# EAGLE design Geiger (EAGLE 7.6.0)
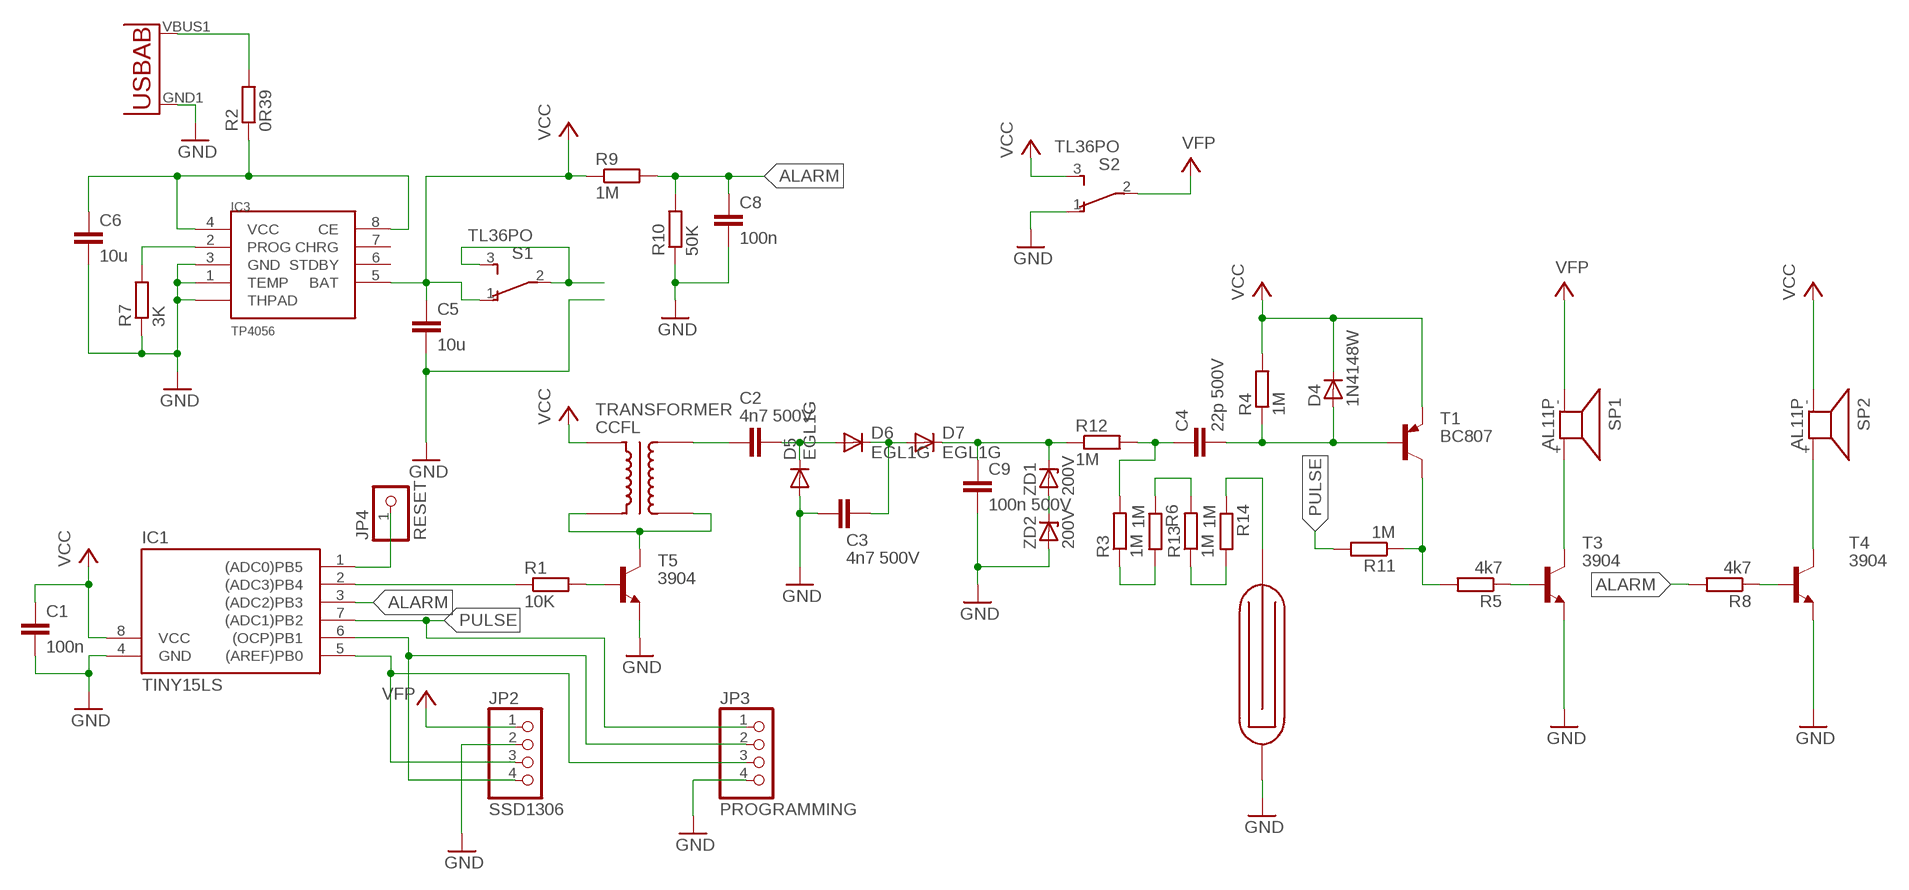
[diagram p0: schematic, sheet 1]

## Parts
C1  100n  C-EUC0805  [C0805]
C2  4n7 500V  C-EUC1206  [C1206]
C3  4n7 500V  C-EUC1206  [C1206]
C4  22p 500V  C-EU050-024X044  [C050-024X044]
C5  10u  C-EUC0805  [C0805]
C6  10u  C-EUC0805  [C0805]
C8  100n  C-EUC0805  [C0805]
C9  100n 500V  C-EU150-054X183  [C150-054X183]
D4  1N4148W  D-SOD123  [SOD123]
D5  EGL1G  PMLL4150  [SOD80C]
D6  EGL1G  PMLL4150  [SOD80C]
D7  EGL1G  PMLL4150  [SOD80C]
IC1  TINY15LS  [SOIC8]
IC3  TP4056  [SOP-8]
JP2  SSD1306  PINHD-1X4  [1X04]
JP3  PROGRAMMING  PINHD-1X4  [1X04]
JP4  RESET  PINHD-1X1  [1X01]
R1  10K  R-EU_R0805  [R0805]
R2  0R39  R-EU_R1206  [R1206]
R3  1M  R-EU_R0805  [R0805]
R4  1M  R-EU_R0805  [R0805]
R5  4k7  R-EU_R0805  [R0805]
R6  1M  R-EU_R0805  [R0805]
R7  3K  R-EU_R0805  [R0805]
R8  4k7  R-EU_R0805  [R0805]
R9  1M  R-EU_R0805  [R0805]
R10  50K  R-EU_R0805  [R0805]
R11  1M  R-EU_R0805  [R0805]
R12  1M  R-EU_R0805  [R0805]
R13  1M  R-EU_R0805  [R0805]
R14  1M  R-EU_R0805  [R0805]
S1  TL36PO  [TL3XPO]
S2  TL36PO  [TL3XPO]
SP1  AL11P  [AL11P]
SP2  AL11P  [AL11P]
T1  BC807  BC807-16-PNP-SOT23-BEC  [SOT23-BEC]
T3  3904  MMBT3904LT1-NPN-SOT23-BEC  [SOT23-BEC]
T4  3904  MMBT3904LT1-NPN-SOT23-BEC  [SOT23-BEC]
T5  3904  MMBT3904LT1-NPN-SOT23-BEC  [SOT23-BEC]
TRANSFORMER  CCFL  [CCFL]
U2  USB  USB""  [USB-MICRO-SMD]
U$1  SBM-20  [SBM-20]
ZD1  200V  ZD-MLL-41  [MELF-MLL41]
ZD2  200V  ZD-MLL-41  [MELF-MLL41]

## Nets
200V: ZD1.A ZD2.C
200V2: C2.2 D5.C D6.A
400V: C9.1 D7.C R12.1 ZD1.C
400V2: C4.1 R3.2 R12.2
400V3: C3.2 D6.C D7.A
ALARM: C8.1 IC1.3((ADC2)PB3) R8.2 R9.2 R10.2
GND: C1.2 C3.1 C5.2 C6.2 C8.2 C9.2 D5.A IC1.4(GND) IC3.1(TEMP) IC3.3(GND) IC3.P$1(THPAD) JP2.2 JP3.4 R7.1 R10.1 S2.1(O) T3.E T4.E T5.E U2.GND1(GND) U$1.P$2 ZD2.A
N$1: SP2.+ T4.C
N$2: C2.1 TRANSFORMER.HV
N$3: R8.1 T4.B
N$4: R1.2 T5.B
N$6: R3.1 R6.2
N$7: R6.1 R13.2
N$8: R14.1 U$1.P$1
N$9: R13.1 R14.2
N$10: R5.2 R11.1 T1.C
N$12: C4.2 D4.A R4.1 T1.B
N$13: IC1.1((ADC0)PB5) JP4.1
N$14: R5.1 T3.B
N$15: S1.2(P) S1.3(S)
N$16: C6.1 IC3.4(VCC) IC3.8(CE) R2.1
N$18: T5.C TRANSFORMER.TR1 TRANSFORMER.TR2
N$19: IC3.2(PROG) R7.2
N$22: IC1.5((AREF)PB0) JP2.3 JP3.3
N$23: IC1.6((OCP)PB1) JP2.4 JP3.2
OSC: IC1.2((ADC3)PB4) R1.1
PULSE: IC1.7((ADC1)PB2) JP3.1 R11.2
SPKR: SP1.+ T3.C
V+: JP2.1 S2.2(P) SP1.- ; supply symbol labelled VFP
VCC: C1.1 C5.1 D4.C IC1.8(VCC) IC3.5(BAT) R4.2 R9.1 S1.1(O) S2.3(S) SP2.- T1.E TRANSFORMER.V+
VCCUSB: R2.2 U2.VBUS1(VBUS)
Unconnected: IC3.6(STDBY) IC3.7(CHRG)

## Library data of the parts
C1-C6 C8 C9 = resistor:C-EU: CAPACITOR, European symbol
D4 = diodes2:D-: DIODE
D5-D7 = diode:PMLL4150: DIODE high speed
IC1 = atmel:TINY15L: MICROCONTROLLER 2.7 V 1 Kbytes FLASH 64 bytes EEPROM 4-channel 10 bit ADC; OC_FARNELL: unknown; OC_NEWARK: unknown
IC3 = Geiger:TP4056
JP2 JP3 = pinhead:PINHD-1X4: PIN HEADER
JP4 = pinhead:PINHD-1X1: PIN HEADER
R1-R14 = resistor:R-EU_: RESISTOR, European symbol
S1 S2 = switch:TL36PO: TINY SWITCH ON - ON Source: http://www2.produktinfo.conrad.com/datenblaetter/700000-724999/705152-da-01-de-Subminiaturschalter_TL_36YO.pdf
SP1 SP2 = buzzer:AL11P: SPEAKER Source: Buerklin; OC_FARNELL: unknown; OC_NEWARK: unknown
T1 = transistor:*-PNP-: PNP Transistror
T3-T5 = transistor:*-NPN-: NPN Transistror BF959 corrected 2008.03.06
TRANSFORMER = Geiger:CCFL
U2 = Geiger:USB: This is a USB AB connector that is compatible with USB OTG. i.e. this connector can serve as a host or device
U$1 = Geiger:SBM-20
ZD1 ZD2 = diodes2:ZD-: Zener diode

## Board
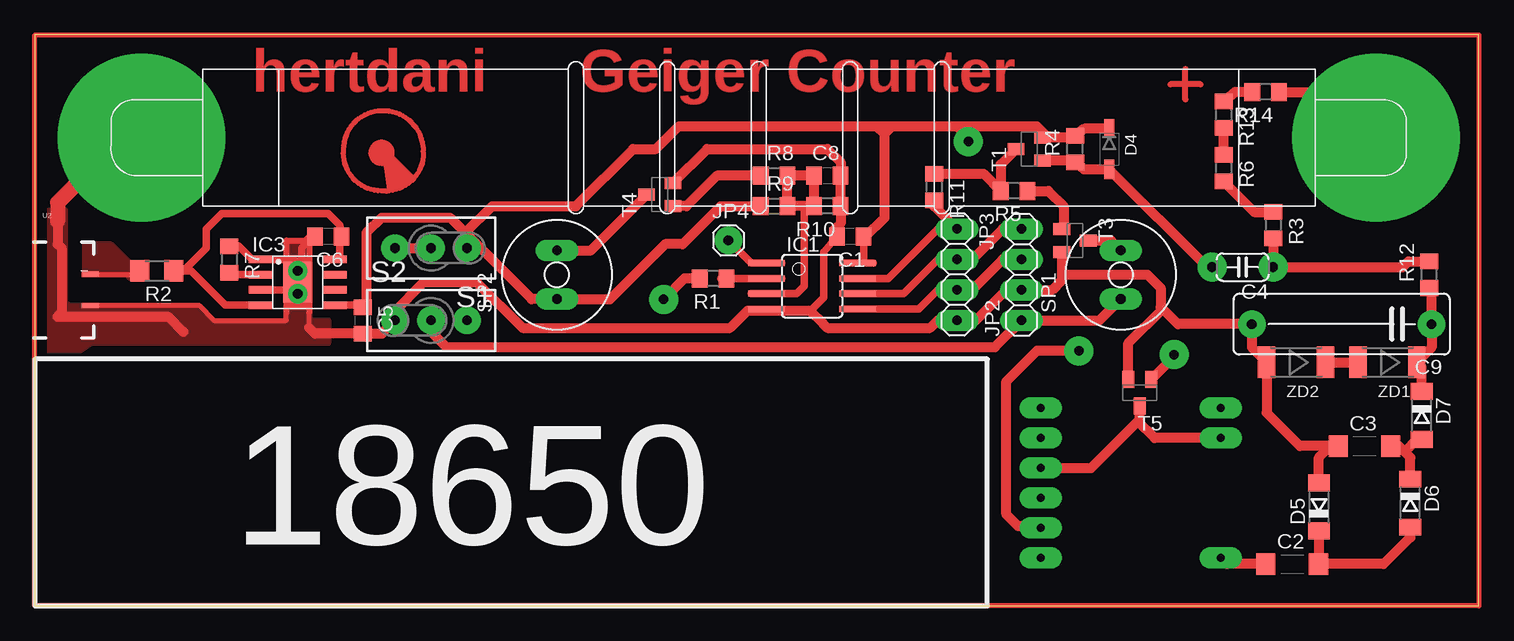
[diagram p1: board, top side]
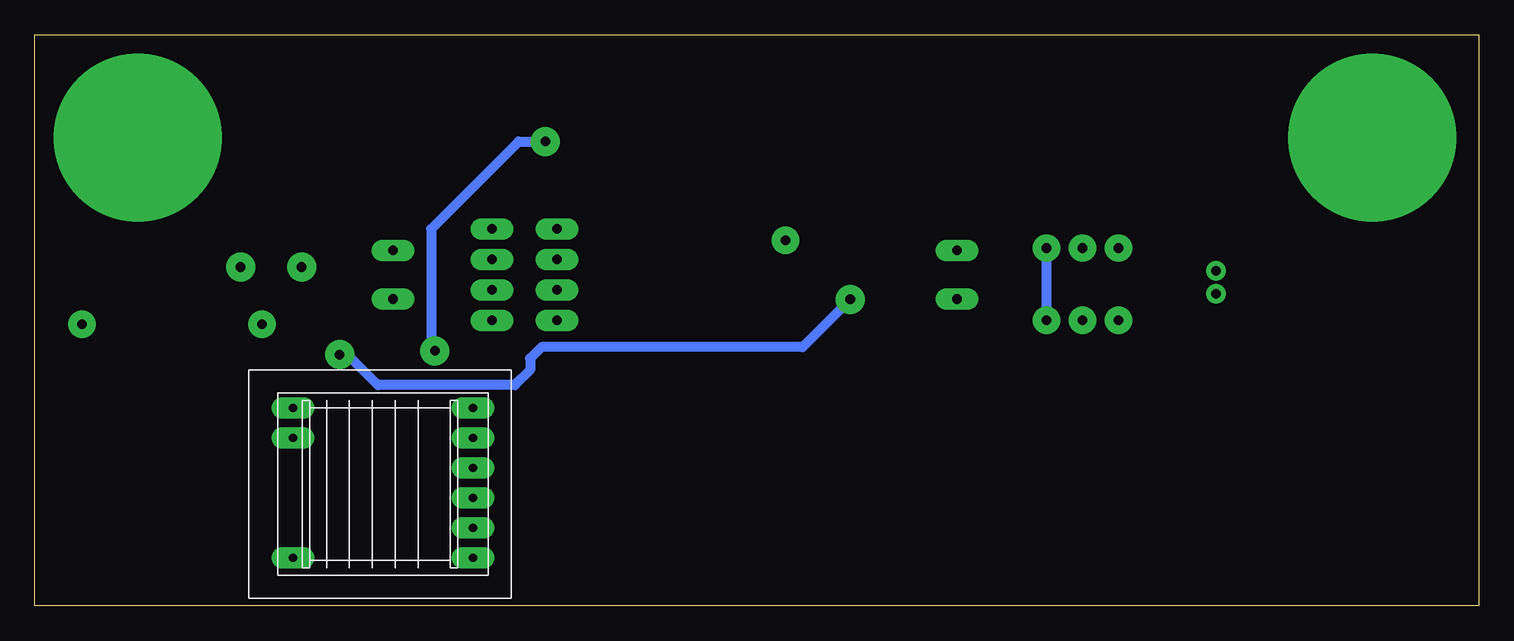
[diagram p2: board, bottom side, seen from below]

Size 120.33 x 47.62 mm. Coordinates in mm from the lower left corner, seen from the top.
Outline: 0,0 120.33,0 120.33,47.62 0,47.62 0,0
Copper layers (1*16): Top 0.035mm / dielectric 1.5mm / Bottom 0.035mm
Design rules "default *": minimum track width 16mil, minimum drill 24mil, track to track 25mil, track to pad 25mil, pad to pad 25mil, via to via 25mil, smd to smd 25mil, copper to edge 40mil, drill to drill 16mil, minimum pad ring 16mil, minimum via ring 16mil, stop-mask expansion 4mil, vias tented up to drill 0mil, thermal gap 10mil

### Footprints (pad centres in the part's own frame; a part is rotated, then mirrored left to right if it is on the bottom)
C0805 = smd 1.3 x 1.5: 1 -1.109,0; 2 1.109,0
C1206 = smd 1.6 x 1.8: 1 -2.194,0; 2 2.194,0
C050-024X044 = drill 0.8 pad 2.413: 1 -2.54,0; 2 2.54,0
C150-054X183 = drill 0.8 pad 2.286: 1 -7.493,0; 2 7.493,0
SOD123 = smd 1.6 x 0.8: A 1.7,0; C -1.7,0
SOD80C = smd 1.4 x 1.8: A 2,0; C -2,0
SOIC8 = smd 0.5 x 3.048: 1 -1.905,-3.789; 2 -0.645,-3.789; 3 0.625,-3.789; 4 1.895,-3.789; 5 1.905,3.789; 6 0.635,3.789; 7 -0.635,3.789; 8 -1.905,3.789
SOP-8 = smd 2.062 x 0.624: 1 -3.067,1.905; 2 -3.067,0.635; 3 -3.067,-0.635; 4 -3.067,-1.905; 5 3.067,-1.905; 6 3.067,-0.635; 7 3.067,0.635; 8 3.067,1.905 | smd 2.4 x 3.4: P$1 0,0
1X04 = drill 0.8 pad 1.778 long: 1 -3.81,0; 2 -1.27,0; 3 1.27,0; 4 3.81,0
1X01 = drill 0.8 pad 2.286: 1 0,0
R0805 = smd 1.3 x 1.5: 1 -1.109,0; 2 1.109,0
R1206 = smd 1.6 x 1.803: 1 -1.422,0; 2 1.422,0
TL3XPO = drill 0.8 pad 2.286: 1 -3,0; 2 0,0; 3 3,0
AL11P = drill 0.8 pad 1.778 long: + 2.032,0; - -2.032,0
SOT23-BEC = smd 1 x 1.4: B -0.95,-1.1; C 0,1.1; E 0.95,-1.1
CCFL = drill 0.7 pad 1.778 long: HV 12.5,15; P$1 12.5,0; P$3 7.5,0; P$5 2.5,0; P$6 0,0; P$7 0,15; TR1 5,0; TR2 2.5,15; V+ 10,0
USB-MICRO-SMD = smd 1.4 x 0.432: GND1 2.7,-1.3; VBUS1 2.7,1.3
SBM-20 = drill 0 pad 13.97: P$1 0,0; P$2 102.87,0
MELF-MLL41 = smd 1.45 x 2.6: A 2.445,0; C -2.445,0

### Placement (x,y rotation side)
C1  67.94,30.8 180 top
C2  104.78,3.49 0 top
C3  110.81,13.34 0 top
C4  100.65,28.26 180 top
C5  27.3,23.81 270 top
C6  24.45,30.8 180 top
C8  66.04,35.88 0 top
C9  108.9,23.5 180 top
D4  89.53,38.1 270 top
D5  107,8.26 90 top
D6  114.62,8.57 270 top
D7  115.57,15.88 270 top
IC1  64.77,26.67 270 top
IC3  21.91,26.99 0 top
JP2  82.23,27.62 90 top
JP3  76.83,27.62 270 top
JP4  57.78,30.48 0 top
R1  56.52,27.3 180 top
R2  10.16,27.94 180 top
R3  103.19,31.75 270 top
R4  86.68,38.1 90 top
R5  81.6,34.61 180 top
R6  99.06,36.51 270 top
R7  16.19,28.89 270 top
R8  61.59,35.88 0 top
R9  61.59,33.34 0 top
R10  66.04,33.34 180 top
R11  74.93,34.92 270 top
R12  116.2,27.62 90 top
R13  99.06,40.96 270 top
R14  102.55,42.86 180 top
S1  33.02,29.84 180 top
S2  33.02,23.81 0 top
SP1  90.49,27.62 90 top
SP2  43.5,27.62 90 top
T1  82.87,38.1 90 top
T3  86.68,30.48 270 top
T4  52.07,34.29 90 top
T5  92.08,17.78 180 top
TRANSFORMER  83.82,16.51 270 top
U2  1.91,26.35 0 top
U$1  111.76,39.05 180 top
ZD1  112.71,20.32 180 top
ZD2  105.09,20.32 180 top

### Tracks (layer width: path | path; a pad name or v marks a point on that pad's centre or on a via)
200V
  Top 0.813: ZD2.C ZD1.A
200V2
  Top 0.813: D5.C 107,3.52 C2.2 112.39,3.49 114.62,5.71 D6.A 114.62,6.35
400V
  Top 0.813: R12.1 116.39,26.48 C9.1 116.39,21.56 ZD1.C 115.57,19.91 D7.C
400V2
  Top 0.813: R3.2 C4.1 113.98,28.26 114.46,28.73 R12.2 116.05,28.57
400V3
  Top 0.813: C3.2 113.67,13.34 114.14,12.86 | D6.C 114.62,12.38 114.14,12.86 | D7.A 115.16,13.88 114.14,12.86
A
  Top 0.406: 29.53,37.47 31.11,35.56 31.11,35.58 arc90 31.1,35.59 | 29.21,34.61 arc90 32.38,37.78 arc90 29.21,41.27 28.89,41.27 arc90 25.72,38.1 25.72,37.78 arc90 28.89,34.61 29.21,34.61 | 29.53,34.77 29.21,37.15 28.89,37.15 | 29.53,34.77 29.84,34.77 29.21,36.99 29.69,37.47 31.43,35.72 31.1,35.59 | 31.1,35.59 30.83,35.48 | 30.83,35.48 29.84,35.08 | 29.21,34.61 29.37,34.61 arc90 29.53,34.77 | 30.8,35.56 30.8,35.51 arc90 30.83,35.48 | 28.89,38.42 28.89,38.1
  Top 0.61: 30.8,35.56 30.16,34.92 29.53,37.15 30.48,35.56 | 29.21,38.1 29.21,37.47 28.57,37.47 28.57,38.1 | 28.57,38.1 28.89,38.1 | 28.57,38.1 28.26,38.1 | 29.53,37.47 31.11,35.88
  Top 0.914: 29.53,37.78 arc90 28.89,38.42 arc90 28.26,37.78 arc90 28.89,37.15 arc90 29.53,37.78
ALARM
  Top 0.406: 62.55,33.34 R9.2
  Top 0.61: IC1.3 61.61,26.04 | 61.61,26.04 59.69,26.04 | 61.61,26.04 63.5,26.04 64.14,26.67 64.14,33.34 64.45,33.34
  Top 0.813: R8.2 R9.2 64.45,33.34 R10.2 C8.1 62.87,35.88
GND  (via drill 0.8)
  Top 0.406: 20.95,25.4 20.95,26.35 20.95,28.57 | 20.95,28.57 21.27,28.89 21.59,28.89 22.23,28.89 22.86,28.89 22.86,29.21 | 20.95,25.08 20.95,24.77 20.95,23.81 14.92,23.81 13.68,25.05 U2.GND1 | 20.95,25.08 20.95,25.4 | 20.95,25.4 22.86,25.4 22.86,24.77 22.86,23.18 | 20.95,25.08 22.54,25.08 | 66.99,35.88 C8.2 | 20.95,28.57 22.86,28.57 | 59.37,24.61 59.54,24.77 IC1.4
  Top 0.508: 22.86,30.48 22.86,24.77 22.86,24.45 | 20.95,24.45 20.95,24.77 20.95,26.35 20.95,30.48 22.54,30.48 | 23.18,30.48 22.54,30.48 | 22.54,30.48 23.18,31.11
  Top 0.61: C1.2 65.72,29.52 65.72,25.72 64.61,24.61 64.45,24.61 | 21.59,28.89 IC3.1 18.1,28.89 16.99,30 R7.1 | IC3.3 20.95,26.35 | C6.2 22.54,30.16 22.23,29.84 22.23,28.89
  Top 0.813: 66.99,30.8 C1.2 66.67,30.96 66.67,31.43 67.15,31.91 R10.1 | R10.1 C8.2 67.15,36.99 66.04,38.1 56.03,38.1 T4.E | 67,33.33 R10.1 | C3.1 107.95,13.34 | 107.95,13.34 105.41,13.34 102.65,16.1 ZD2.A 101.41,21.56 C9.2 95.25,23.5 93.98,24.77 | 85.58,27.16 84.77,26.35 JP2.2 80.96,26.35 78.42,23.81 JP3.4 75.25,23.81 74.61,23.18 66.04,23.18 65.73,23.48 65.73,23.5 64.62,24.61 64.45,24.61 59.37,24.61 57.94,23.18 40.64,23.18 36.83,26.99 32.38,26.99 29.84,24.45 29.84,23.99 S2.1 28.91,22.7 C5.2 23.33,22.7 22.86,23.18 | 85.58,27.16 85.72,27.62 92.71,27.62 93.82,26.51 93.82,24.92 93.98,24.77 | T3.E 85.58,27.16 | U$1.P$2 7.94,39.05 | 1.91,33.02 1.91,32.38 | 1.91,32.07 1.91,30.16 2.22,29.84 2.22,24.45 1.91,24.13 11.11,24.13 12.38,22.86 | T5.E 91.12,21.91 93.98,24.77 | D5.A 107,12.38 107.95,13.34
  Top 1.27: 7.94,39.05 6.99,39.05 | 1.91,32.07 1.91,32.38 1.91,33.66 8.26,40.01 8.26,39.69 U$1.P$2
  other vias: 21.91,27.94 21.91,26.04
  pour Top: 20.95,23.5 20.95,30.48 22.86,30.48 22.86,23.81 24.45,23.81 24.45,21.91 4.13,21.91 4.13,24.77 13.65,24.77 14.92,23.5
  pour Top: 0.32,33.02 2.54,33.02 2.54,25.4 2.86,25.08 4.76,25.08 4.76,21.91 3.81,21.27 0.64,21.27
N$1
  Top 0.813: SP2.+ 46.33,29.65 T4.C
N$2
  Top 0.813: 98.94,4.45 TRANSFORMER.HV 99.34,3.49 C2.1
N$3
  Top 0.406: R8.1 60.64,35.88
  Top 0.813: R8.1 56.83,35.88 54.29,33.34 T4.B
N$4  (via drill 0.8 pad 2.41)
  Top 0.813: R1.2 54.13,27.3 v52.39,25.56 | v94.93,20.95 94.93,20.79 T5.B
  Bottom 0.813: v52.39,25.56 56.36,21.59 78.11,21.59 79.06,20.64 79.06,19.68 80.33,18.41 91.76,18.41 94.3,20.95 v94.93,20.95
N$5
  Top 0.406: 0,0 0,47.62 120.33,47.62 120.33,0 0,0
N$6
  Top 0.813: R6.2 101.61,32.86 R3.1
N$7
  Top 0.813: R6.1 R13.2
N$8
  Top 0.813: R14.1 107.95,42.86 U$1.P$1
N$9
  Top 0.813: R14.2 100.02,42.86 R13.1
N$10
  Top 0.813: T1.C 80.49,36.82 R5.2 79.06,36.03 R11.1
N$12
  Top 0.813: T1.B 86.52,37.15 R4.1 87.43,36.4 D4.A 97.68,28.26 C4.2
N$13
  Top 0.61: 58.42,30.16 58.1,30.16 JP4.1 59.69,28.57 60.96,28.57 IC1.1 62.23,28.57
N$14
  Top 0.813: R5.1 84.45,34.61 85.72,33.34 85.72,31.58 T3.B
N$15
  Top 0.813: S1.3 S1.2
N$16
  Top 0.61: IC3.4 15.88,25.08 13.02,27.94 12.38,27.94 | 12.38,27.94 R2.1 | 12.38,27.94 14.29,29.84 14.29,31.43 15.56,32.7 24.45,32.7 25.4,31.75 C6.1 25.4,30.8 25.4,28.89 IC3.8
  Top 0.813: 11.84,27.68 R2.1
N$18
  Top 0.813: TRANSFORMER.TR1 88.03,11.51 91.92,15.4 | 91.92,15.4 92.08,15.56 T5.C | TRANSFORMER.TR2 93.31,14.01 91.92,15.4
N$19
  Top 0.61: IC3.2 16.51,27.62 R7.2
N$22
  Top 0.61: 76.52,26.35 JP3.3 75.25,26.35 73.66,24.77 IC1.5 67.31,24.77
  Top 0.813: JP3.3 78.11,26.35 80.64,28.89 JP2.3
N$23
  Top 0.61: 76.52,28.89 JP3.2 75.25,28.89 72.39,26.04 IC1.6 67.31,26.04
  Top 0.813: JP3.2 78.11,28.89 80.64,31.43 JP2.4
OSC
  Top 0.406: 61.59,27.3 61.6,27.32 IC1.2 61.61,27.3
  Top 0.61: 57.15,27.3 R1.1 61.59,27.3 61.61,27.3 62.23,27.3
PULSE
  Top 0.61: 76.52,31.43 JP3.1 75.25,31.43 71.12,27.3 IC1.7 67.31,27.3
  Top 0.813: JP3.1 74.93,33.34 R11.2
SPKR
  Top 0.813: T3.C 89.66,30.48 SP1.+
V+
  Top 0.813: SP1.- 88.71,23.81 JP2.1 80.01,21.59 34.29,21.59 33.02,22.86 S2.2
VCC  (via drill 0.8 pad 2.41)
  Top 0.61: IC3.5 27.62,25.08 C5.1 | 68.9,30.8 C1.1 69.05,28.57 | 69.05,28.57 69.85,28.57 | 67.31,28.57 IC1.8 69.05,28.57
  Top 0.813: 86.79,39.16 R4.2 | 84.45,39.05 T1.E | C1.1 69.22,30.8 70.8,32.38 70.8,39.37 | 70.17,40.01 53.66,40.01 51.75,38.1 49.85,38.1 45.09,33.34 38.1,33.34 35.88,31.11 | 70.17,40.01 71.44,40.01 | 78.42,40.01 83.5,40.01 84.45,39.05 | R9.1 57.15,33.34 53.98,30.16 52.51,30.16 47.94,25.59 SP2.- 41.4,25.59 36.51,30.48 | 70.8,39.37 70.17,40.01 | 70.8,39.37 71.44,40.01 | 77.79,39.37 78.42,40.01 | 71.44,40.01 76.83,40.01 | 76.83,40.01 78.42,40.01 | v77.79,38.73 77.79,39.05 76.83,40.01 | D4.C 87.43,39.8 R4.2 | C5.1 27.62,25.4 27.62,31.11 28.89,32.38 34.61,32.38 35.88,31.11 | S1.1 36.02,29.99 36.51,30.48 | 35.88,31.11 36.51,30.48 | TRANSFORMER.V+ 83.66,6.67 81.92,6.67 80.96,7.62 80.96,18.73 83.5,21.27 v87,21.27 | 84.45,39.05 84.46,39.05 86.52,39.05 R4.2
  Bottom 0.813: S2.3 S1.1 | 77.79,38.42 v77.79,38.73 80.01,38.73 87.31,31.43 87.31,21.59 v87,21.27 86.36,21.27
VCCUSB
  Top 0.406: U2.VBUS1 8.45,27.65 R2.2
  pour Top: 4.13,27.62 7.62,27.62 7.94,27.3 9.21,27.3 9.21,28.57 8.26,28.57 7.94,28.57 6.35,30.16 4.13,30.16

### Text on the board
Top: hertdani | Geiger Counter
tPlace: 18650